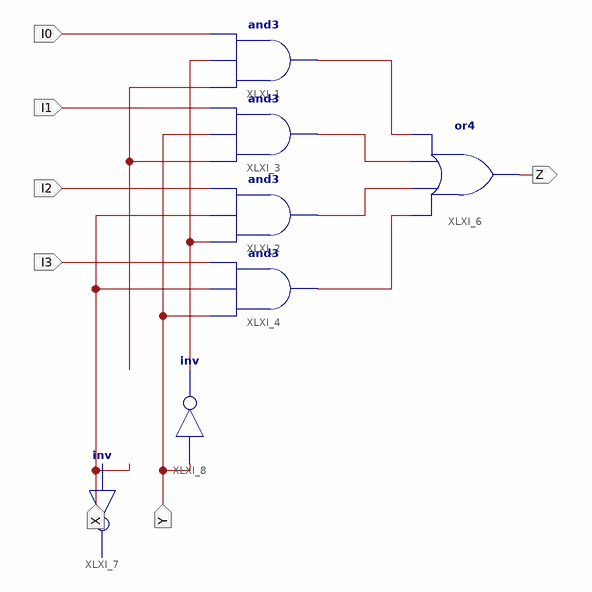
[diagram p0: schematic sheet 1]
// Xilinx ISE schematic MUX.sch (spartan6) as structural Verilog: 7 symbols, 7 ports
module MUX (
  input  Y,
  input  X,
  input  I3,
  input  I2,
  input  I1,
  input  I0,
  output Z
);

  wire XLXN_5, XLXN_6, XLXN_7, XLXN_23, XLXN_25, XLXN_26;

  and XLXI_1 (XLXN_5, XLXN_26, XLXN_25, I0);
  and XLXI_2 (XLXN_7, XLXN_25, X, I2);
  and XLXI_3 (XLXN_6, XLXN_26, Y, I1);
  and XLXI_4 (XLXN_23, Y, X, I3);
  or XLXI_6 (Z, XLXN_23, XLXN_7, XLXN_6, XLXN_5);
  not XLXI_7 (XLXN_26, X);
  not XLXI_8 (XLXN_25, Y);
endmodule
